# Altium project Projet M1S1 board.PrjPcb
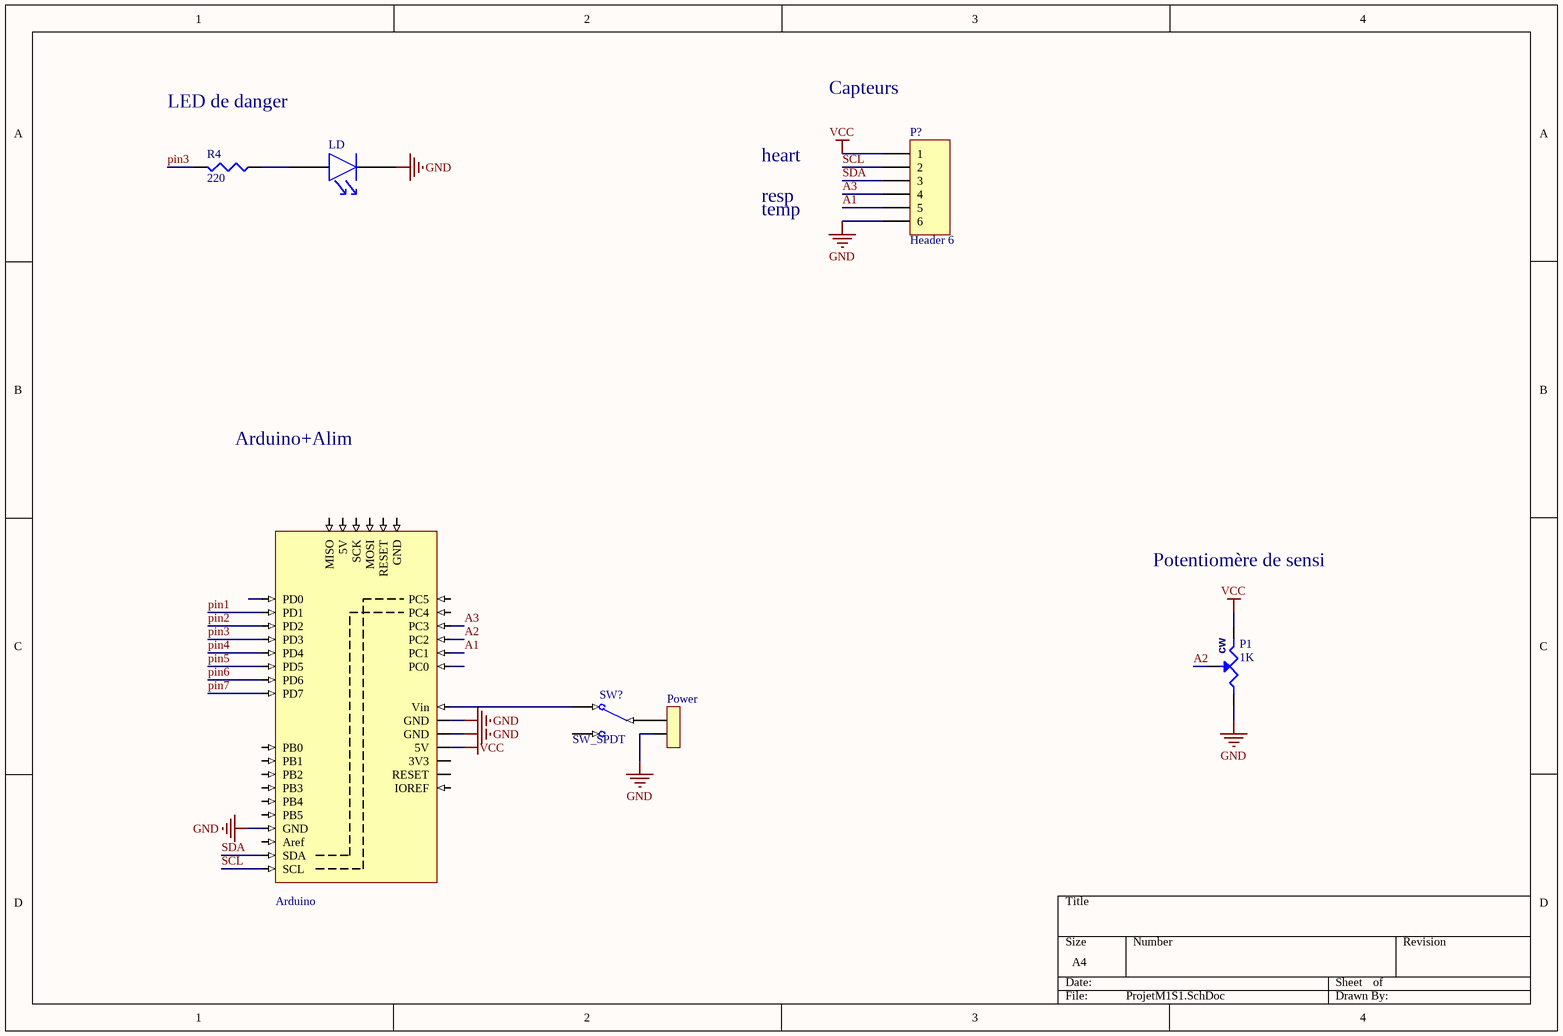
[diagram p0: ProjetM1S1.SchDoc]
1 sheet, 7 parts. Net scope: global (net labels, ports and power ports of the same name join across sheets).
Board file: ProjetM1S1.PCBDOC

## Sheet ProjetM1S1.SchDoc
size A4

### Parts
Arduino  ARDUINO_UNO  [ARDUINO_UNO]  (value not drawn)
LD  (no value)  [LED5]
P1  value 1K  [BOURNS3310Y]  (hidden comment: POT_SINGLE)
P?  Header 6  [HDR1X6]
Power  (no value)  [POWER2]
R4  value 220  [0805]  (hidden comment: RES)
SW?  SW_SPDT  [1K2_V]

### Nets
GND: Arduino.4(GND) Arduino.5(GND) Arduino.27(GND) LD.K P1.1 P?.6 Power.1
VCC: Arduino.3(5V) P1.3 P?.1
A1: Arduino.8(PC1) P?.5
A2: Arduino.9(PC2) P1.2
A3: Arduino.10(PC3) P?.4
pin1: Arduino.14(PD1)
pin2: Arduino.15(PD2)
pin3: Arduino.16(PD3) R4.2
pin4: Arduino.17(PD4)
pin5: Arduino.18(PD5)
pin6: Arduino.19(PD6)
pin7: Arduino.20(PD7)
SCL: Arduino.30(SCL) P?.2
SDA: Arduino.29(SDA) P?.3
NetArduino_6: Arduino.6(Vin) SW?.2(A)
NetLD_A: LD.A R4.1
NetPower_2: Power.2 SW?.1

Not connected (* = marked no-connect by the designer): Arduino 0(IOREF) 1(RESET) 2(3V3) 7(PC0) 11(PC4) 12(PC5) 13(PD0) 21(PB0) 22(PB1) 23(PB2) 24(PB3) 25(PB4) 26(PB5) 28(Aref) 31(MISO) 32(5V) 33(SCK) 34(MOSI) 35(RESET) 36(GND); SW? 3(B)

### Notes on the sheet
- LED de danger
- Capteurs
- heart
- temp
- resp
- Arduino+Alim
- Potentiomère de sensi
- (in symbol POT_SINGLE) cw

### Library data of the parts
LD = LED: LED 5mm/3mm/CMS
P1 = POT_SINGLE: potentiomètre simple; Set Position: 0.5
P? = Header 6: Header, 6-Pin; LatestRevisionDate: 17-Jul-2002; LatestRevisionNote: Re-released for DXP Platform.; Publisher: Altium Limited
Power = POWER2: connecteur alim 2 pôles
R4 = RES: resistance